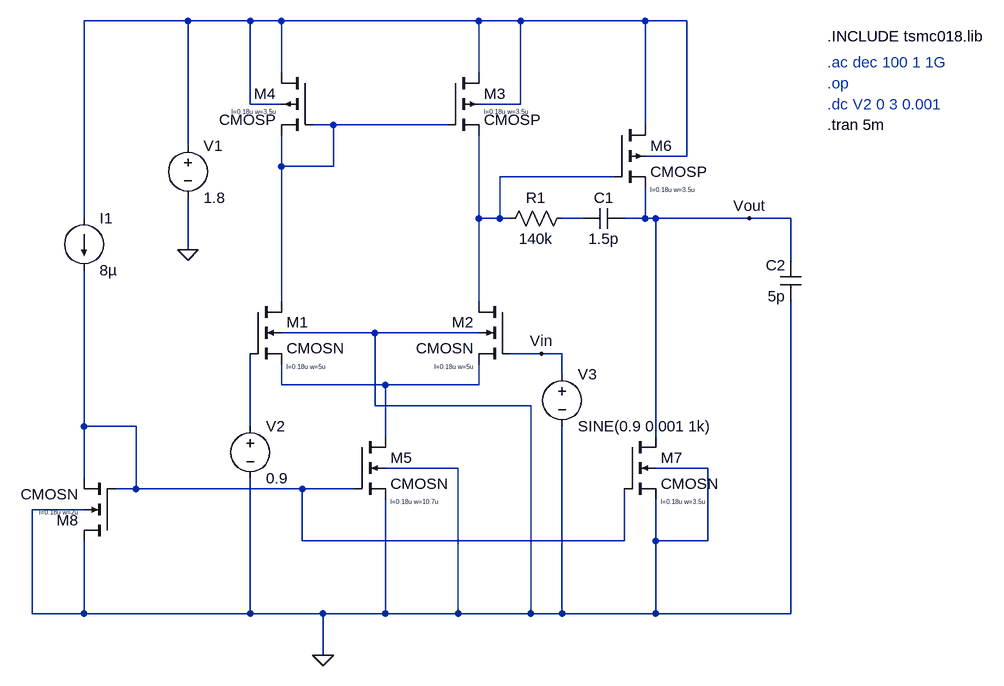
[diagram p0: schematic CMOS Project_Trans_vfinal.asc]
CMOS Project_Trans_vfinal.asc, the LTspice schematic file:
Version 4.1
SHEET 1 1260 836
WIRE 16 -192 -144 -192
WIRE 112 -192 16 -192
WIRE 160 -192 112 -192
WIRE 464 -192 160 -192
WIRE 528 -192 464 -192
WIRE 720 -192 528 -192
WIRE 784 -192 720 -192
WIRE 160 -112 160 -192
WIRE 464 -112 464 -192
WIRE 112 -64 112 -192
WIRE 160 -64 112 -64
WIRE 528 -64 528 -192
WIRE 528 -64 464 -64
WIRE 240 -32 208 -32
WIRE 416 -32 240 -32
WIRE 720 -32 720 -192
WIRE 16 0 16 -192
WIRE 784 16 784 -192
WIRE 784 16 720 16
WIRE 160 32 160 -16
WIRE 240 32 240 -32
WIRE 240 32 160 32
WIRE 672 48 496 48
WIRE -144 112 -144 -192
WIRE 464 112 464 -16
WIRE 496 112 496 48
WIRE 496 112 464 112
WIRE 512 112 496 112
WIRE 624 112 592 112
WIRE 720 112 720 64
WIRE 720 112 688 112
WIRE 736 112 720 112
WIRE 880 112 736 112
WIRE 944 112 880 112
WIRE 16 160 16 80
WIRE 944 176 944 112
WIRE 160 240 160 32
WIRE 464 240 464 112
WIRE 304 288 160 288
WIRE 464 288 304 288
WIRE 560 320 512 320
WIRE 592 320 560 320
WIRE 592 352 592 320
WIRE 160 368 160 336
WIRE 320 368 160 368
WIRE 464 368 464 336
WIRE 464 368 320 368
WIRE 304 400 304 288
WIRE 544 400 304 400
WIRE -144 432 -144 192
WIRE -64 432 -144 432
WIRE 112 432 112 320
WIRE 320 448 320 368
WIRE 736 448 736 112
WIRE 432 496 320 496
WIRE 816 496 736 496
WIRE -144 512 -144 432
WIRE -64 528 -64 432
WIRE -64 528 -96 528
WIRE 192 528 -64 528
WIRE 272 528 192 528
WIRE -144 560 -224 560
WIRE 192 608 192 528
WIRE 688 608 688 528
WIRE 688 608 192 608
WIRE 736 608 736 544
WIRE 816 608 816 496
WIRE 816 608 736 608
WIRE -224 720 -224 560
WIRE -144 720 -144 608
WIRE -144 720 -224 720
WIRE 112 720 112 512
WIRE 112 720 -144 720
WIRE 224 720 112 720
WIRE 320 720 320 544
WIRE 320 720 224 720
WIRE 432 720 432 496
WIRE 432 720 320 720
WIRE 544 720 544 400
WIRE 544 720 432 720
WIRE 592 720 592 432
WIRE 592 720 544 720
WIRE 736 720 736 608
WIRE 736 720 592 720
WIRE 944 720 944 240
WIRE 944 720 736 720
WIRE 224 784 224 720
FLAG 224 784 0
FLAG 16 160 0
FLAG 880 112 Vout
FLAG 560 320 Vin
SYMBOL cmosn 272 448 R0
WINDOW 123 56 100 Left 0
SYMATTR Value2 l=0.18u w=10.7u
SYMATTR InstName M5
SYMBOL cmosp 672 -32 R0
WINDOW 123 56 100 Left 0
SYMATTR Value2 l=0.18u w=3.5u
SYMATTR InstName M6
SYMBOL cmosn 688 448 R0
WINDOW 123 56 100 Left 0
SYMATTR Value2 l=0.18u w=3.5u
SYMATTR InstName M7
SYMBOL cap 688 96 R90
WINDOW 0 0 32 VBottom 2
WINDOW 3 32 32 VTop 2
SYMATTR InstName C1
SYMATTR Value 1.5p
SYMBOL current -144 112 R0
WINDOW 123 0 0 Left 0
WINDOW 39 0 0 Left 0
SYMATTR InstName I1
SYMATTR Value 8µ
SYMBOL cmosn -96 608 R180
WINDOW 123 56 44 Left 0
SYMATTR Value2 l=0.18u w=2u
SYMATTR InstName M8
SYMBOL cap 960 240 R180
WINDOW 0 24 56 Left 2
WINDOW 3 24 8 Left 2
SYMATTR InstName C2
SYMATTR Value 5p
SYMBOL voltage 16 -16 R0
WINDOW 123 0 0 Left 0
WINDOW 39 0 0 Left 0
SYMATTR InstName V1
SYMATTR Value 1.8
SYMBOL cmosp 416 -112 R0
WINDOW 123 56 60 Left 0
SYMATTR Value2 l=0.18u w=3.5u
SYMATTR InstName M3
SYMBOL cmosp 208 -112 M0
WINDOW 123 56 60 Left 0
SYMATTR Value2 l=0.18u w=3.5u
SYMATTR InstName M4
SYMBOL cmosn 112 240 R0
WINDOW 123 56 100 Left 0
SYMATTR Value2 l=0.18u w=5u
SYMATTR InstName M1
SYMBOL cmosn 512 240 M0
WINDOW 123 56 100 Left 0
SYMATTR Value2 l=0.18u w=5u
SYMATTR InstName M2
SYMBOL res 608 96 R90
WINDOW 0 0 56 VBottom 2
WINDOW 3 32 56 VTop 2
SYMATTR InstName R1
SYMATTR Value 140k
SYMBOL voltage 112 416 R0
WINDOW 123 0 0 Left 0
WINDOW 39 0 0 Left 0
SYMATTR InstName V2
SYMATTR Value 0.9
SYMBOL voltage 592 336 R0
WINDOW 123 0 0 Left 0
WINDOW 39 0 0 Left 0
SYMATTR InstName V3
SYMATTR Value SINE(0.9 0.001 1k)
TEXT 1000 -168 Left 2 !.INCLUDE tsmc018.lib
TEXT 1000 -96 Left 2 ;.op
TEXT 1000 -128 Left 2 ;.ac dec 100 1 1G
TEXT 1000 -64 Left 2 ;.dc V2 0 3 0.001
TEXT 1000 -32 Left 2 !.tran 5m

The netlist it stands for:
* CMOS Project_Trans_vfinal.asc
M5 N005 N006 0 0 CMOSN l=0.18u w=10.7u
M6 N001 N003 Vout N001 CMOSP l=0.18u w=3.5u
M7 Vout N006 0 0 CMOSN l=0.18u w=3.5u
C1 Vout N004 1.5p
I1 N001 N006 8µ
M8 0 N006 N006 0 CMOSN l=0.18u w=2u
C2 0 Vout 5p
V1 N001 0 1.8
M3 N001 N002 N003 N001 CMOSP l=0.18u w=3.5u
M4 N001 N002 N002 N001 CMOSP l=0.18u w=3.5u
M1 N002 N007 N005 0 CMOSN l=0.18u w=5u
M2 N003 Vin N005 0 CMOSN l=0.18u w=5u
R1 N004 N003 140k
V2 N007 0 0.9
V3 Vin 0 SINE(0.9 0.001 1k)
.model NMOS NMOS
.model PMOS PMOS
.lib standard.mos
.INCLUDE tsmc018.lib
* .op
* .ac dec 100 1 1G
* .dc V2 0 3 0.001
.tran 5m
.backanno
.end